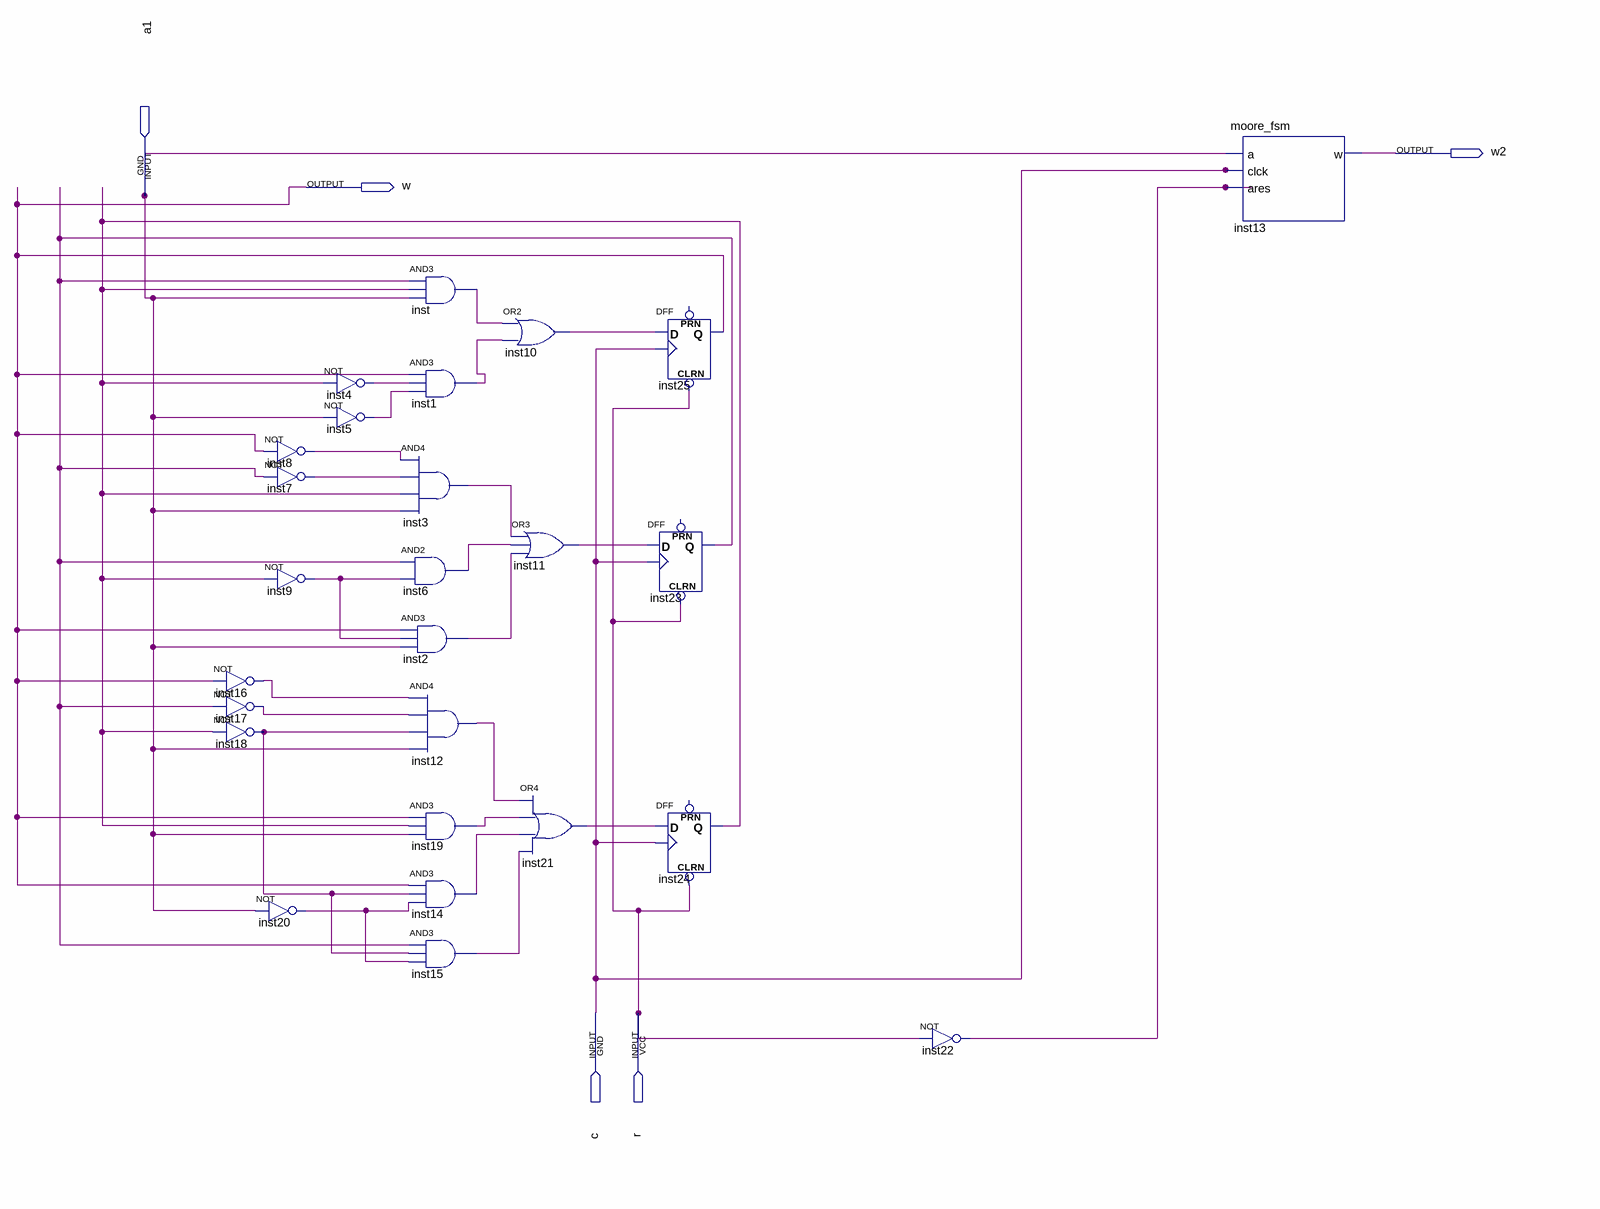
[diagram p0: schematic sheet]
// Quartus schematic four.bdf as structural Verilog: 26 symbols, 5 pins
module four (
  input  a1,
  input  c,
  input  r,
  output w2,
  output w
);

  wire inst1_out, inst2_out, inst3_out, inst4_out, inst5_out, inst6_out, inst7_out, inst8_out, inst9_out,
       inst10_out, inst11_out, inst12_out, inst14_out, inst15_out, inst16_out, inst17_out, inst18_out,
       inst19_out, inst20_out, inst21_out, inst22_out, inst23_q, inst24_q, inst_out;

  not inst16 (inst16_out, w);
  not inst17 (inst17_out, inst23_q);
  not inst18 (inst18_out, inst24_q);
  not inst8 (inst8_out, w);
  not inst7 (inst7_out, inst23_q);
  not inst9 (inst9_out, inst24_q);
  not inst20 (inst20_out, a1);
  not inst4 (inst4_out, inst24_q);
  not inst5 (inst5_out, a1);
  and inst (inst_out, inst23_q, inst24_q, a1);
  and inst1 (inst1_out, w, inst4_out, inst5_out);
  and inst3 (inst3_out, inst8_out, inst7_out, inst24_q, a1);
  and inst6 (inst6_out, inst23_q, inst9_out);
  and inst2 (inst2_out, w, inst9_out, a1);
  and inst12 (inst12_out, inst16_out, inst17_out, inst18_out, a1);
  and inst19 (inst19_out, w, inst24_q, a1);
  and inst14 (inst14_out, w, inst18_out, inst20_out);
  and inst15 (inst15_out, inst23_q, inst18_out, inst20_out);
  or inst10 (inst10_out, inst_out, inst1_out);
  or inst11 (inst11_out, inst3_out, inst6_out, inst2_out);
  or inst21 (inst21_out, inst12_out, inst19_out, inst14_out, inst15_out);
  DFF inst23 (.CLRN(r), .CLK(c), .D(inst11_out), .Q(inst23_q));  // open: PRN
  DFF inst25 (.CLRN(r), .CLK(c), .D(inst10_out), .Q(w));  // open: PRN
  DFF inst24 (.CLRN(r), .CLK(c), .D(inst21_out), .Q(inst24_q));  // open: PRN
  not inst22 (inst22_out, r);
  moore_fsm inst13 (.a(a1), .clck(c), .ares(inst22_out), .w(w2));
endmodule
